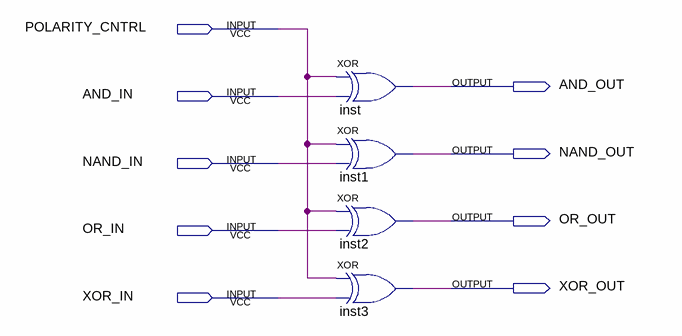
[diagram p0: schematic sheet]
// Quartus schematic postlabschem_gates.bdf as structural Verilog: 4 symbols, 9 pins
module postlabschem_gates (
  input  POLARITY_CNTRL,
  input  AND_IN,
  input  NAND_IN,
  input  OR_IN,
  input  XOR_IN,
  output AND_OUT,
  output NAND_OUT,
  output OR_OUT,
  output XOR_OUT
);

  xor inst (AND_OUT, POLARITY_CNTRL, AND_IN);
  xor inst1 (NAND_OUT, POLARITY_CNTRL, NAND_IN);
  xor inst2 (OR_OUT, POLARITY_CNTRL, OR_IN);
  xor inst3 (XOR_OUT, POLARITY_CNTRL, XOR_IN);
endmodule
